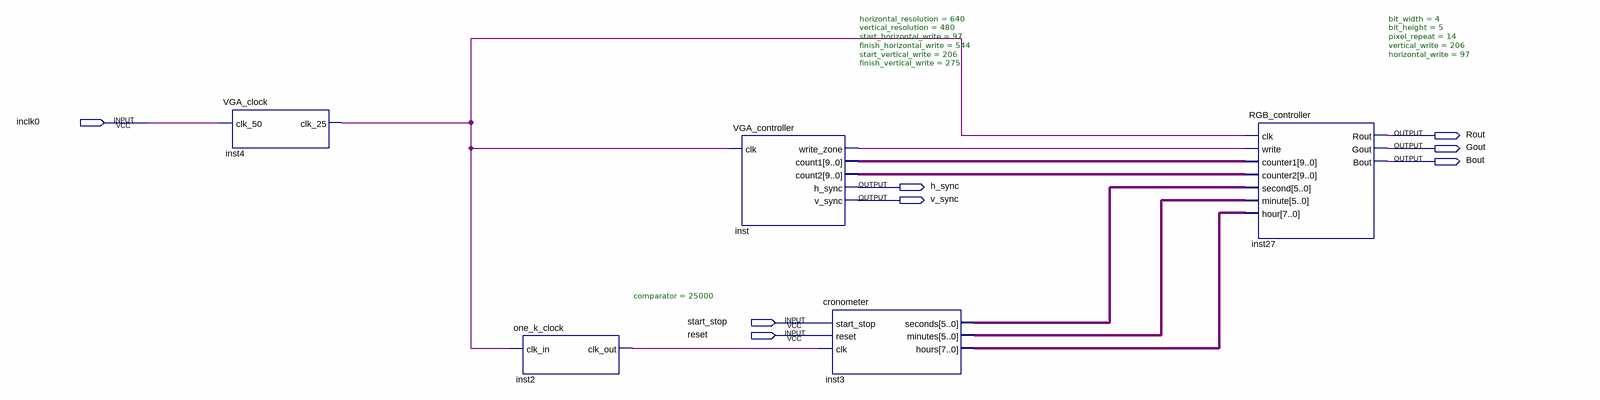
[diagram p0: schematic sheet]
// Quartus schematic elecroIII.bdf as structural Verilog: 5 symbols, 8 pins
module elecroIII (
  input  inclk0,
  input  start_stop,
  input  reset,
  output Rout,
  output Gout,
  output Bout,
  output h_sync,
  output v_sync
);

  wire inst2_clk_out, inst4_clk_25, inst_write_zone;
  wire [5:0] inst3_minutes, inst3_seconds;
  wire [7:0] inst3_hours;
  wire [9:0] inst_count1, inst_count2;

  VGA_clock inst4 (.clk_50(inclk0), .clk_25(inst4_clk_25));
  one_k_clock #(.comparator(25000)) inst2 (.clk_in(inst4_clk_25), .clk_out(inst2_clk_out));
  VGA_controller #(.horizontal_resolution(640), .vertical_resolution(480), .start_horizontal_write(97), .finish_horizontal_write(544), .start_vertical_write(206), .finish_vertical_write(275)) inst (
    .clk(inst4_clk_25), .write_zone(inst_write_zone), .count1(inst_count1), .count2(inst_count2),
    .h_sync(h_sync), .v_sync(v_sync));
  cronometer inst3 (
    .start_stop(start_stop), .reset(reset), .clk(inst2_clk_out), .seconds(inst3_seconds),
    .minutes(inst3_minutes), .hours(inst3_hours));
  RGB_controller #(.bit_width(4), .bit_height(5), .pixel_repeat(14), .vertical_write(206), .horizontal_write(97)) inst27 (
    .clk(inst4_clk_25), .write(inst_write_zone), .counter1(inst_count1), .counter2(inst_count2),
    .second(inst3_seconds), .minute(inst3_minutes), .hour(inst3_hours), .Rout(Rout), .Gout(Gout), .Bout(Bout));
endmodule
